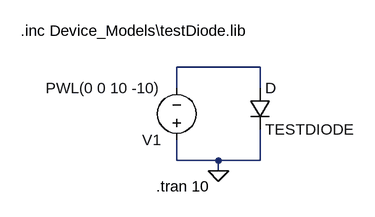
[diagram p0: schematic DiodeTest.asc]
DiodeTest.asc, the LTspice schematic file:
Version 4
SHEET 1 880 680
WIRE 288 112 160 112
WIRE 160 144 160 112
WIRE 288 144 288 112
WIRE 160 256 160 224
WIRE 224 256 160 256
WIRE 288 256 288 208
WIRE 288 256 224 256
WIRE 224 272 224 256
FLAG 224 272 0
SYMBOL diode 272 144 R0
SYMATTR InstName D
SYMATTR Value TESTDIODE
SYMATTR Prefix X
SYMBOL voltage 160 240 R180
WINDOW 123 0 0 Left 0
WINDOW 39 0 0 Left 0
SYMATTR InstName V1
SYMATTR Value PWL(0 0 10 -10)
TEXT 128 296 Left 2 !.tran 10
TEXT -80 56 Left 2 !.inc Device_Models\\testDiode.lib

The netlist it stands for:
* DiodeTest.asc
XD N001 0 TESTDIODE  ; pins + -
V1 0 N001 PWL(0 0 10 -10)
.tran 10
.inc Device_Models\testDiode.lib
.backanno
.end